# EAGLE design Antenna-V2 (EAGLE 9.3.2)
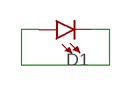
[diagram p0: schematic, sheet 1]

## Parts
D1  LED1206  [LED-1206]

## Nets
N$1: D1.A D1.C

## Library data of the parts
D1 = SparkFun-LED:LED: LED (Generic) Standard schematic elements and footprints for 5mm, 3mm, 1206, and 0603 sized LEDs. Generic LEDs with no color specified.

## Board
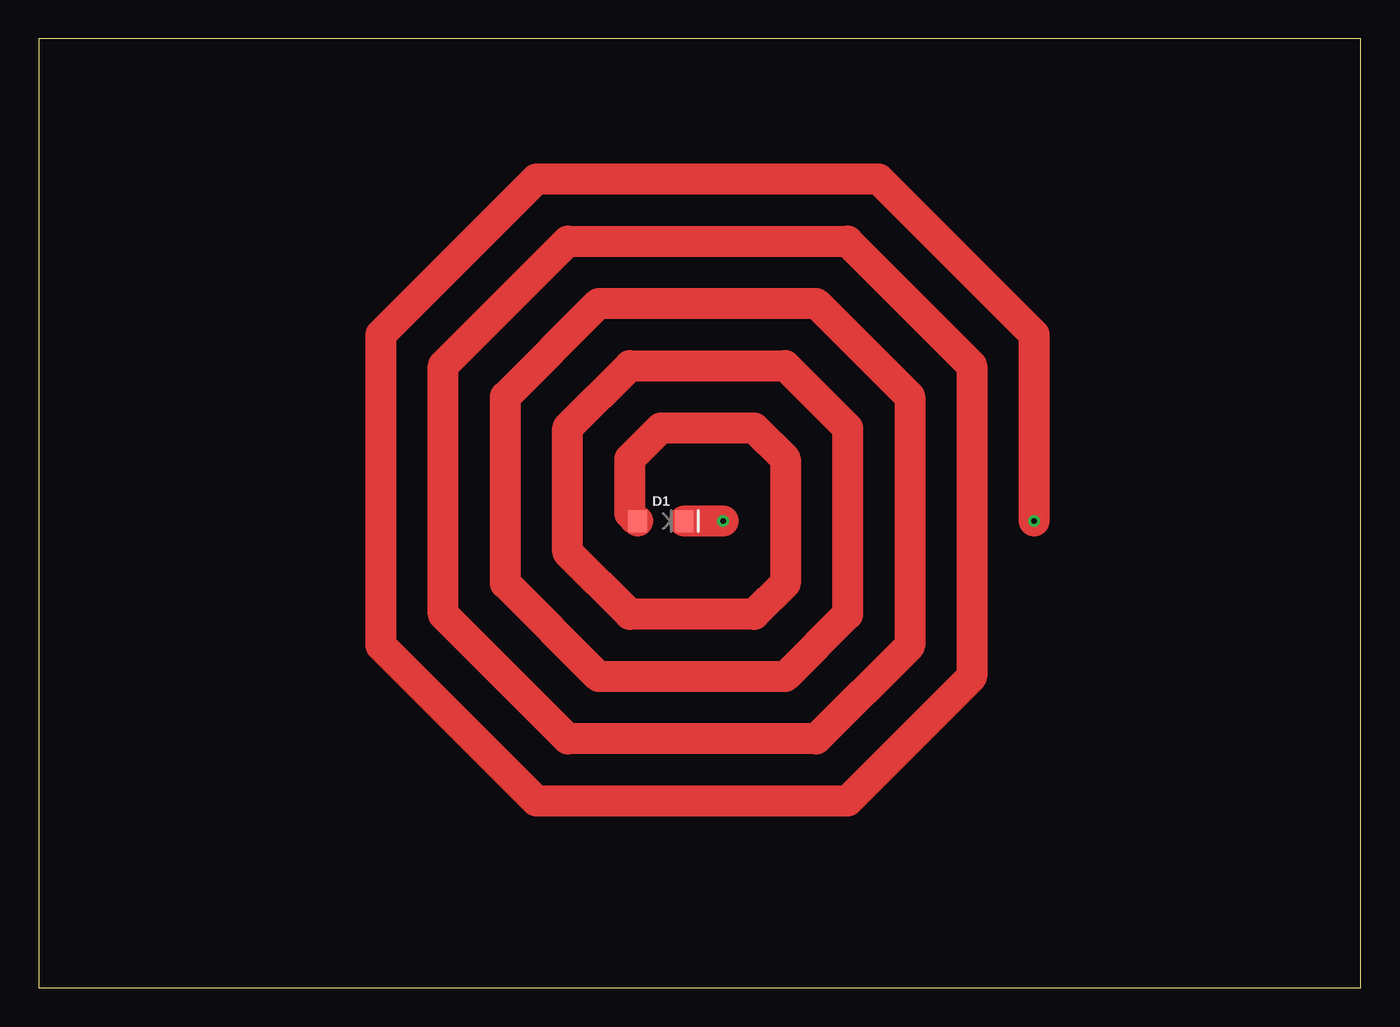
[diagram p1: board, top side]
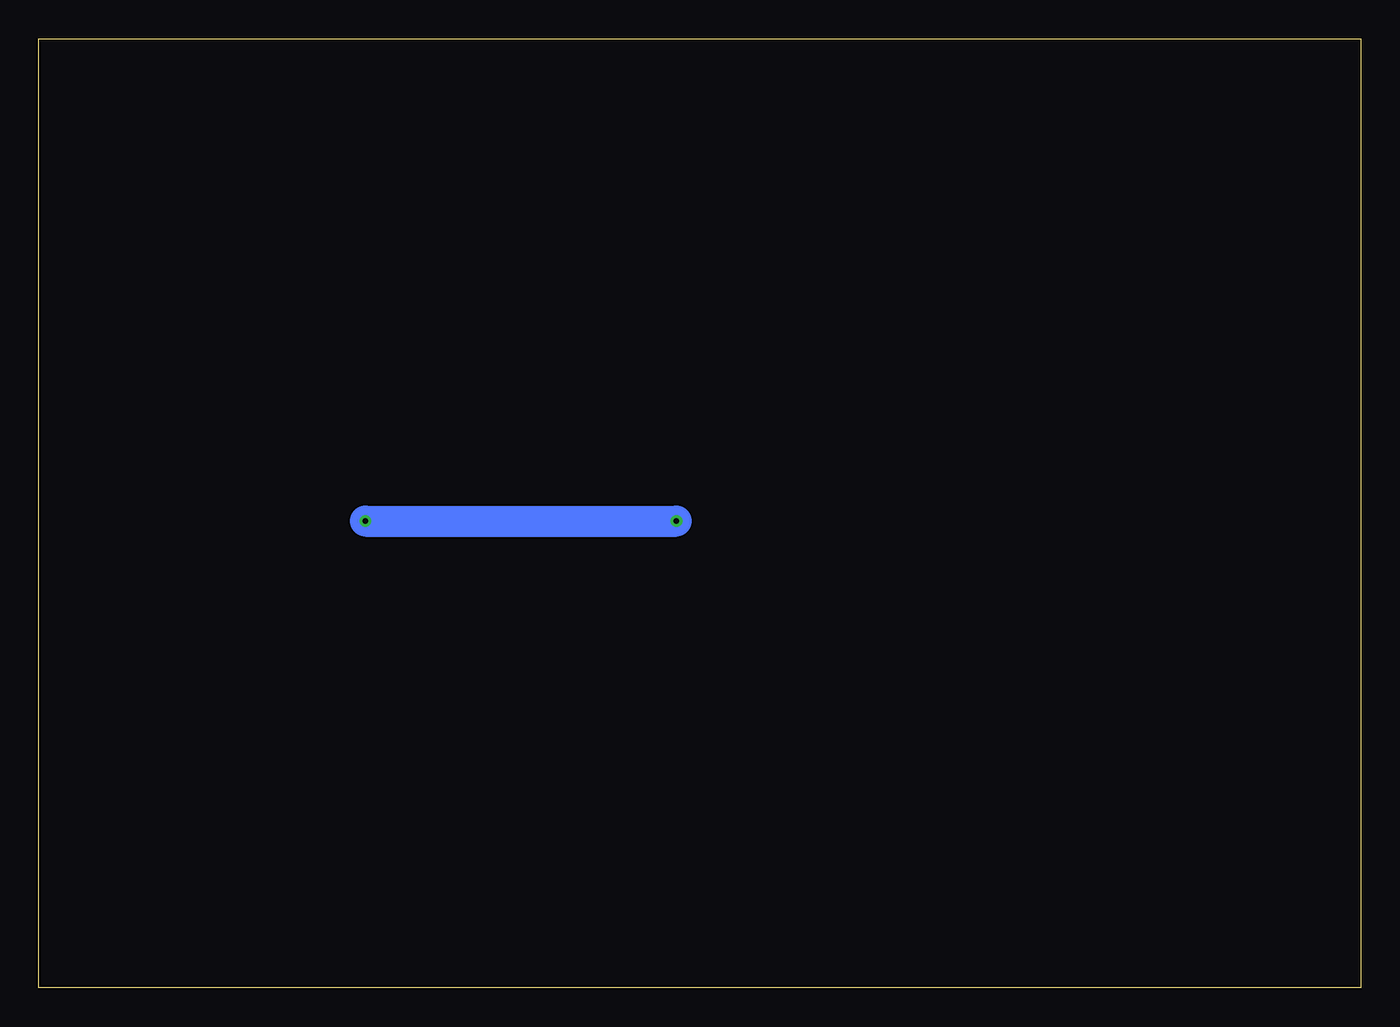
[diagram p2: board, bottom side, seen from below]

Size 85 x 61 mm. Coordinates in mm from the lower left corner, seen from the top.
Outline: 0,0 85,0 85,61 0,61 0,0
Copper layers (1*16): Top 0.035mm / dielectric 1.5mm / Bottom 0.035mm
Design rules "default": minimum track width 6mil, minimum drill 0.35mm, track to track 6mil, track to pad 6mil, pad to pad 6mil, via to via 6mil, smd to smd 6mil, copper to edge 40mil, drill to drill 6mil, minimum pad ring 10mil, minimum via ring 8mil, stop-mask expansion 4mil, vias tented up to drill 0mil, thermal gap 10mil

### Footprints (pad centres in the part's own frame; a part is rotated, then mirrored left to right if it is on the bottom)
LED-1206 = smd 1.2 x 1.4: A -1.5,0; C 1.5,0

### Placement (x,y rotation side)
D1  40,30 0 top

### Tracks (layer width: path | path; a pad name or v marks a point on that pad's centre or on a via)
N$1  (via drill 0.35)
  Top 2: D1.A 38,30.5 38,34 40,36 46,36 48,34 48,26 46,24 38,24 34,28 34,36 38,40 48,40 52,36 52,24 48,20 36,20 30,26 30,38 36,44 50,44 56,38 56,22 50,16 34,16 26,24 26,40 34,48 52,48 60,40 60,20 52,12 32,12 22,22 22,42 32,52 54,52 64,42 v64,30 | v44,30 D1.C
  Bottom 2: v64,30 v44,30